# EAGLE design RGB-hi (EAGLE 5.04)
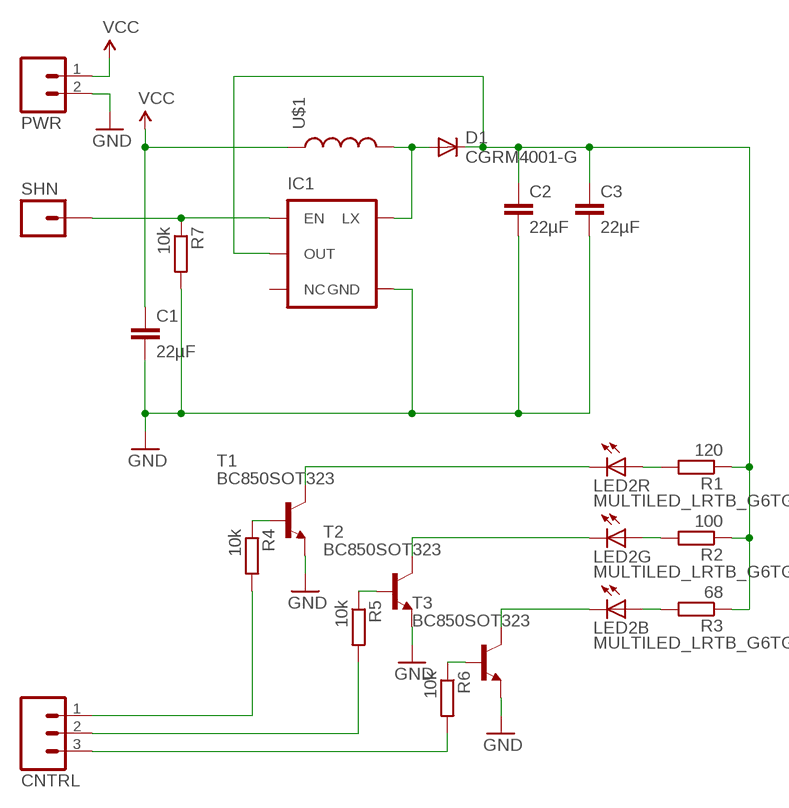
[diagram p0: schematic, sheet 1]

## Parts
C1  22µF  C-EUC0805  [C0805]
C2  22µF  C-EUC0805  [C0805]
C3  22µF  C-EUC0805  [C0805]
CNTRL  M03PTH  [1X03]
D1  CGRM4001-G  [SOD-123_MINI-SMA]
IC1  V_REG_NCP1400SOT23-5  [SOT23-5]
LED2  MULTILED_LRTB_G6TG  [P-LCC-6_TOPLED]
PWR  M02PTH  [1X02]
R1  120  R-EU_R0603  [R0603]
R2  100  R-EU_R0603  [R0603]
R3  68  R-EU_R0603  [R0603]
R4  10k  R-EU_R0603  [R0603]
R5  10k  R-EU_R0603  [R0603]
R6  10k  R-EU_R0603  [R0603]
R7  10k  R-EU_M0805  [M0805]
SHN  M01PTH  [1X01]
T1  BC850SOT323  [SOT323-BEC]
T2  BC850SOT323  [SOT323-BEC]
T3  BC850SOT323  [SOT323-BEC]
U$1  INDUCTORCR75  [CR75]

## Nets
GND: C1.2 C2.2 C3.2 IC1.4(GND) PWR.2 R7.2 T1.E T2.E T3.E
N$1: LED2.C1(R:C) T1.C
N$2: D1.A IC1.5(LX) U$1.P$2
N$3: C2.1 C3.1 D1.C IC1.2(OUT) R1.1 R2.1 R3.1
N$6: LED2.A1(R:A) R1.2
N$8: LED2.A2(G:A) R2.2
N$9: LED2.C2(G:C) T2.C
N$10: LED2.A3(B:A) R3.2
N$11: LED2.C3(B:C) T3.C
N$12: R4.1 T1.B
N$13: R5.1 T2.B
N$14: R6.1 T3.B
N$15: CNTRL.1 R4.2
N$16: CNTRL.2 R5.2
N$17: CNTRL.3 R6.2
N$19: IC1.1(EN) R7.1 SHN.1
VCC: C1.1 PWR.1 U$1.P$1
Unconnected: IC1.3(NC)

## Library data of the parts
C1-C3 = rcl:C-EU: CAPACITOR, European symbol
CNTRL = SparkFun:M03: Header 3 Standard 3-pin 0.1" header. Use with straight break away headers (SKU : PRT-00116), right angle break away headers (PRT-00553), swiss pins (PRT-00743), machine pins (PRT-00117), and female headers (PRT-00115). Molex polarized connector foot print use with SKU : PRT-08232 with associated crimp pins and housings.
D1 = diode:CGRM400*-G: Molded plasitc,JEDEC SOD-123/Mini SMA Source: Comchip CGRM4001-G.pdf
IC1 = SparkFun:V_REG_NCP1400: Switching step-up voltage regulator NCP1400 switiching regulator takes single cell AA and outputs 100mA at 3.3V or 5V with minimal number of external components.
LED2 = led:MULTILED_LRTB_G6TG: 6-lead MULTILED® Enhanced optical Power LED (ThinFilm® / ThinGaN®) Source. OSRAM - LRTB_G6TG.pdf
PWR = SparkFun:M02: Header 2 Standard 2-pin 0.1" header. Use with straight break away headers (SKU : PRT-00116), right angle break away headers (PRT-00553), swiss pins (PRT-00743), machine pins (PRT-00117), and female headers (PRT-00115). Molex polarized connector foot print use with SKU : PRT-08233 with associated crimp pins and housings.
R1-R7 = rcl:R-EU_: RESISTOR, European symbol
SHN = SparkFun:M01: Header 1 Standard 1-pin 0.1" header. Use with straight break away headers (SKU : PRT-00116), right angle break away headers (PRT-00553), swiss pins (PRT-00743), machine pins (PRT-00117), and female headers (PRT-00115).
T1-T3 = additional:BC850: NPN TRANSISTOR
U$1 = SparkFun:INDUCTOR: Inductors Basic Inductor/Choke - 0603 and 1206. Footprints are not proven and vary greatly between part numbers.

## Board
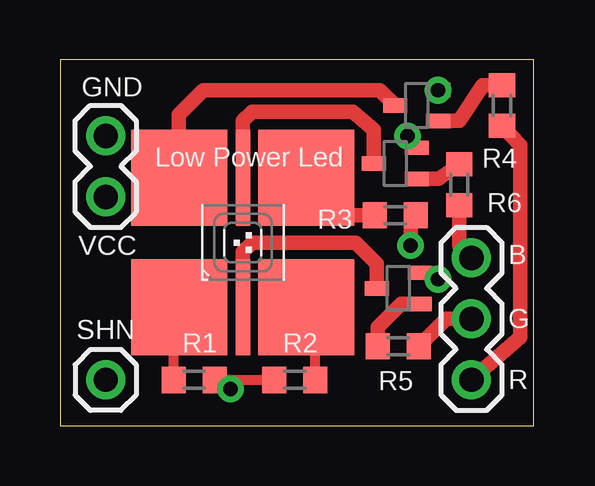
[diagram p1: board, top side]
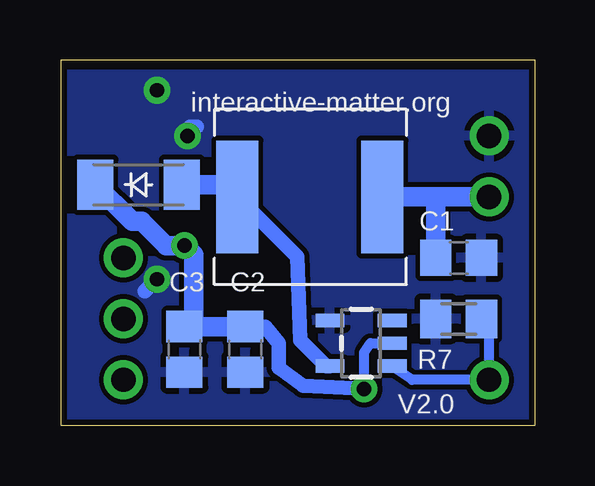
[diagram p2: board, bottom side, seen from below]

Size 19.74 x 15.23 mm. Coordinates in mm from the lower left corner, seen from the top.
Outline: 0,0 19.74,0 19.74,15.23 0,15.23 0,0
Copper layers (1*16): Top 0.035mm / dielectric 1.5mm / Bottom 0.035mm
Design rules "SparkFun": minimum track width 8mil, minimum drill 20mil, track to track 8mil, track to pad 8mil, pad to pad 8mil, via to via 8mil, smd to smd 0mil, copper to edge 10mil, drill to drill 8mil, minimum pad ring 12mil, minimum via ring 10mil, stop-mask expansion 4mil, vias tented up to drill 25mil, thermal gap 10mil

### Footprints (pad centres in the part's own frame; a part is rotated, then mirrored left to right if it is on the bottom)
C0805 = smd 1.3 x 1.5: 1 -0.95,0; 2 0.95,0
1X03 = drill 1.016 round: 1 0,0; 2 2.54,0; 3 5.08,0
SOD-123_MINI-SMA = smd 1.5 x 2.1: A 1.8,0; C -1.8,0
SOT23-5 = smd 0.55 x 1.2: 1 -0.95,-1.3; 2 0,-1.3; 3 0.95,-1.3; 4 0.95,1.3; 5 -0.95,1.3
P-LCC-6_TOPLED = smd 4 x 4: A1 -2.65,-2.7; A2 2.65,-2.7; A3 2.65,2.7; C1 -2.65,2.7 | smd 0.6 x 4: C2 0,-2.7; C3 0,2.7
1X02 = drill 1.016 round: 1 0,0; 2 2.54,0
R0603 = smd 1 x 1.1: 1 -0.85,0; 2 0.85,0
M0805 = smd 1.3 x 1.6: 1 -0.95,0; 2 0.95,0
1X01 = drill 1.016 round: 1 0,0
SOT323-BEC = smd 0.6 x 1: B -0.65,-0.9; C 0,0.9; E 0.65,-0.9
CR75 = smd 1.75 x 4.7: P$1 0,0; P$2 6.05,0

### Placement (x,y rotation side)
C1  3.17,6.98 0 bottom
C2  12.06,3.17 270 bottom
C3  14.61,3.17 270 bottom
CNTRL  17.15,1.91 90 top
D1  16.51,10.03 0 bottom
IC1  7.24,3.43 90 bottom
LED2  7.62,7.62 0 top
PWR  1.91,9.53 90 top
R1  5.59,1.91 180 top
R2  9.78,1.91 0 top
R3  13.97,8.76 180 top
R4  18.42,13.33 270 top
R5  14.1,3.3 0 top
R6  16.64,10.03 270 top
R7  3.17,4.45 180 bottom
SHN  1.91,1.91 0 top
T1  14.86,13.33 90 top
T2  14.1,5.71 90 top
T3  13.97,10.92 90 top
U$1  6.35,9.53 180 bottom

### Tracks (layer width: path | path; a pad name or v marks a point on that pad's centre or on a via)
GND  (via drill 0.6)
  Top 0.61: T1.E 15.9,13.84 v15.75,13.97 | T3.E 14.48,11.96 v14.48,12.06 | T2.E 15.52,6.35 v15.75,6.1
  Bottom 0.61: v15.75,13.97 15.62,14.22 | v14.48,12.06 14.35,12.45 14.1,12.45 | v15.75,6.1 16.26,5.59
  pour Bottom: -0.64,14.61 19.69,14.61 19.69,-0.64 -0.64,-0.64
N$1
  Top 0.61: T1.C 13.32,13.97 5.97,13.97 4.95,12.95 4.95,10.34 LED2.C1
N$2
  Bottom 0.61: IC1.5 8.7,2.48 9.78,3.56 9.91,7.03 U$1.P$2
  Bottom 0.813: U$1.P$2 12.91,10.03 D1.A
N$3  (via drill 0.6)
  Top 0.406: R1.1 7.49,1.91 | 7.49,1.91 R2.1 | 7.49,1.91 v7.11,1.52
  Top 0.61: R3.1 14.61,8.55 v14.61,7.49
  Bottom 0.406: IC1.2 6.86,3.43 7.11,3.05 v7.11,1.52
  Bottom 0.61: C2.1 11.24,4.12 10.67,3.43 10.67,2.41 9.65,1.65 v7.11,1.52
  Bottom 0.813: C2.1 C3.1 14.22,4.51 14.22,7.11 v14.61,7.49 15.37,7.49 16.38,8.51 16.79,8.51 D1.C
N$6
  Top 0.406: R1.2 4.74,4.69 LED2.A1
N$8
  Top 0.406: R2.2 10.63,4.56 LED2.A2
N$9
  Top 0.61: T2.C 13.2,6.74 12.32,7.62 8,7.62 7.62,7.24 LED2.C2
N$10
  Top 0.61: R3.2 11.83,8.76 LED2.A3
N$11
  Top 0.61: T3.C 13.07,12.33 12.19,13.08 8,13.08 7.62,12.7 LED2.C3
N$12
  Top 0.61: T1.B 15.77,12.7 16.64,12.7 17.61,14.19 R4.1
N$13
  Top 0.61: R5.1 13.25,4.1 14.22,5.08 14.98,5.08 T2.B
N$14
  Top 0.61: R6.1 15.77,10.27 T3.B
N$15
  Top 0.61: CNTRL.1 19.18,3.68 19.18,11.68 R4.2
N$16
  Top 0.61: CNTRL.2 16.09,4.45 R5.2
N$17
  Top 0.61: CNTRL.3 16.64,7.49 R6.2
N$19
  Bottom 0.406: R7.1 1.91,4.12 SHN.1 5.11,1.91 IC1.1
VCC
  Bottom 0.813: 4.19,9.53 PWR.1 | 4.19,9.53 U$1.P$1 | C1.1 4.12,9.46 4.19,9.53

### Text on the board
tNames: GND | Low Power Led | VCC | B | G | R
bNames: interactive-matter.org | V2.0